# Altium project Line_follower1.PrjPcb
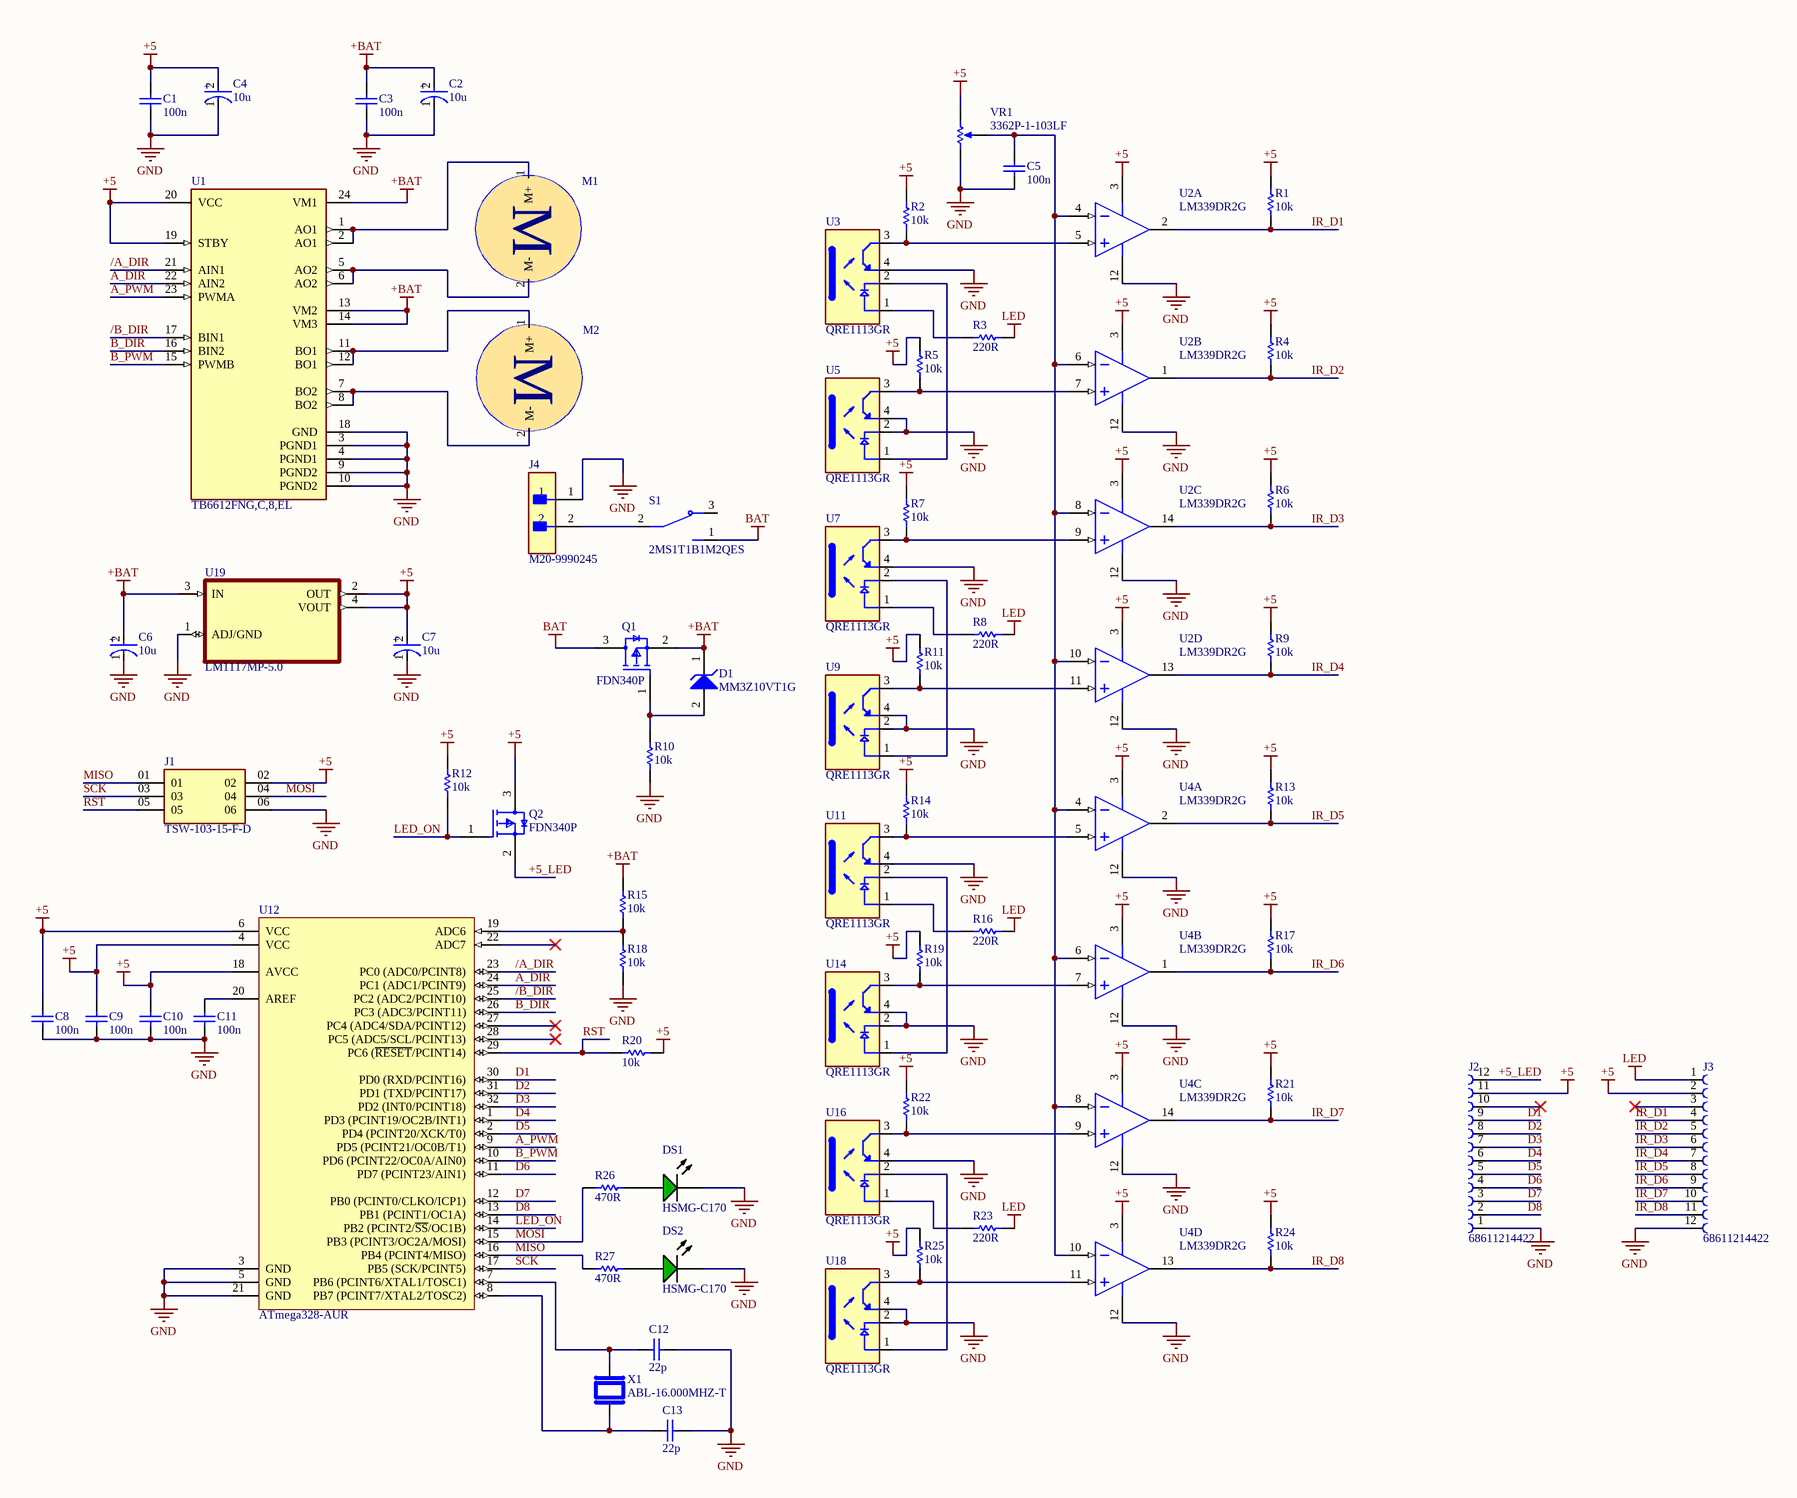
[diagram p0: Line_follower1_Sheet.SchDoc]
1 sheet, 67 parts. Net scope: global (net labels, ports and power ports of the same name join across sheets).
Board file: Line_follower1_PCB.PcbDoc

## Sheet Line_follower1_Sheet.SchDoc
size A2; SheetNumber: 1; SheetTotal: 1

### Parts
C1  100n  [CAPC2013X88X50LL20T25]
C2  10u  [FP-T491B106K020AT-MFG]
C3  100n  [CAPC2013X88X50LL20T25]
C4  10u  [FP-T491B106K020AT-MFG]
C5  100n  [CAPC2013X88X50LL20T25]
C6  10u  [FP-T491B106K020AT-MFG]
C7  10u  [FP-T491B106K020AT-MFG]
C8  100n  [CAPC2013X88X50LL20T25]
C9  100n  [CAPC2013X88X50LL20T25]
C10  100n  [CAPC2013X88X50LL20T25]
C11  100n  [CAPC2013X88X50LL20T25]
C12  22p  [CAPC2013X88X50LL20T25]
C13  22p  [CAPC2013X88X50LL20T25]
D1  MM3Z10VT1G  [ONSC-SOD-323-2-477-02_V]
DS1  HSMG-C170  [AVAG-HSMX-C170_V]
DS2  HSMG-C170  [AVAG-HSMX-C170_V]
J1  TSW-103-15-F-D  [SAMTEC_TSW-103-15-F-D]
J2  68611214422  [68611214422]
J3  68611214422  [68611214422]
J4  M20-9990245  [FP-M20-9990245-MFG]
M1  Component_1  [PCBComponent_1]  (value not drawn)
M2  Component_1  [PCBComponent_1]  (value not drawn)
Q1  FDN340P  [FP-527AG-MFG]
Q2  FDN340P  [FP-527AG-MFG]
R1  10k  [RESC0805(2012)_L]
R2  10k  [RESC0805(2012)_L]
R3  220R  [RESC0805(2012)_L]
R4  10k  [RESC0805(2012)_L]
R5  10k  [RESC0805(2012)_L]
R6  10k  [RESC0805(2012)_L]
R7  10k  [RESC0805(2012)_L]
R8  220R  [RESC0805(2012)_L]
R9  10k  [RESC0805(2012)_L]
R10  10k  [RESC0805(2012)_L]
R11  10k  [RESC0805(2012)_L]
R12  10k  [RESC0805(2012)_L]
R13  10k  [RESC0805(2012)_L]
R14  10k  [RESC0805(2012)_L]
R15  10k  [RESC0805(2012)_L]
R16  220R  [RESC0805(2012)_L]
R17  10k  [RESC0805(2012)_L]
R18  10k  [RESC0805(2012)_L]
R19  10k  [RESC0805(2012)_L]
R20  10k  [RESC0805(2012)_L]
R21  10k  [RESC0805(2012)_L]
R22  10k  [RESC0805(2012)_L]
R23  220R  [RESC0805(2012)_L]
R24  10k  [RESC0805(2012)_L]
R25  10k  [RESC0805(2012)_L]
R26  470R  [RESC0805(2012)_L]
R27  470R  [RESC0805(2012)_L]
S1  2MS1T1B1M2QES  [SW_2MS1T1B1M2QES]
U1  TB6612FNG,C,8,EL  [FP-SSOP24-P-300-0_65A-IPC_A]
U2  LM339DR2G  [ONSC-SOIC-14-751A-03_V]  (parts A,B,C,D of 4)  (no BOM)
U3  QRE1113GR  [SOIC180P460X187-4N]
U4  LM339DR2G  [ONSC-SOIC-14-751A-03_V]  (parts A,B,C,D of 4)
U5  QRE1113GR  [SOIC180P460X187-4N]
U7  QRE1113GR  [SOIC180P460X187-4N]
U9  QRE1113GR  [SOIC180P460X187-4N]
U11  QRE1113GR  [SOIC180P460X187-4N]
U12  ATmega328-AUR  [32A_L]
U14  QRE1113GR  [SOIC180P460X187-4N]
U16  QRE1113GR  [SOIC180P460X187-4N]
U18  QRE1113GR  [SOIC180P460X187-4N]
U19  LM1117MP-5.0  [SOT230P700X180-4N]
VR1  3362P-1-103LF  [BOUR-3362P]
X1  ABL-16.000MHZ-T  [XTAL_HC49P488W46L1150T500H350]

### Nets
+5: C1.2 C4.2(A) C7.2(A) C8.2 C9.2 C10.2 J1.02 J2.11 J3.2 Q2.3(D) R1.2 R2.2 R4.2 R5.2 R6.2 R7.2 R9.2 R11.2 R12.2 R13.2 R14.2 R17.2 R19.2 R20.1 R21.2 R22.2 R24.2 R25.2 U1.19(STBY) U1.20(VCC) U2.3(VCC) U4.3(VCC) U12.4(VCC) U12.6(VCC) U12.18(AVCC) U19.2(OUT) U19.4(VOUT) VR1.3(CW)
+BAT: C2.2(A) C3.2 C6.2(A) D1.1(K) Q1.2(S) R15.2 U1.13(VM2) U1.14(VM3) U1.24(VM1) U19.3(IN)
BAT: Q1.3(D) S1.1
GND: C1.1 C2.1(C) C3.1 C4.1(C) C5.1 C6.1(C) C7.1(C) C8.1 C9.1 C10.1 C11.1 C12.2 C13.2 DS1.2(K) DS2.2(K) J1.06 J2.1 J3.12 J4.1 R10.1 R18.1 U1.3(PGND1) U1.4(PGND1) U1.9(PGND2) U1.10(PGND2) U1.18(GND) U2.12(GND) U3.4(ET) U4.12(GND) U5.2(C) U5.4(ET) U7.4(ET) U9.2(C) U9.4(ET) U11.4(ET) U12.3(GND) U12.5(GND) U12.21(GND) U14.2(C) U14.4(ET) U16.4(ET) U18.2(C) U18.4(ET) U19.1(ADJ/GND) VR1.1(CCW)
LED: J3.1 R3.1 R8.1 R16.1 R23.1
+5_LED: J2.12 Q2.2(S)
/A_DIR: U1.21(AIN1) U12.23(PC0_(ADC0/PCINT8))
/B_DIR: U1.17(BIN1) U12.25(PC2_(ADC2/PCINT10))
A_DIR: U1.22(AIN2) U12.24(PC1_(ADC1/PCINT9))
A_PWM: U1.23(PWMA) U12.9(PD5_(PCINT21/OC0B/T1))
B_DIR: U1.16(BIN2) U12.26(PC3_(ADC3/PCINT11))
B_PWM: U1.15(PWMB) U12.10(PD6_(PCINT22/OC0A/AIN0))
D1: J2.9 U12.30(PD0_(RXD/PCINT16))
D2: J2.8 U12.31(PD1_(TXD/PCINT17))
D3: J2.7 U12.32(PD2_(INT0/PCINT18))
D4: J2.6 U12.1(PD3_(PCINT19/OC2B/INT1))
D5: J2.5 U12.2(PD4_(PCINT20/XCK/T0))
D6: J2.4 U12.11(PD7_(PCINT23/AIN1))
D7: J2.3 U12.12(PB0_(PCINT0/CLKO/ICP1))
D8: J2.2 U12.13(PB1_(PCINT1/OC1A))
IR_D1: J3.4 R1.1 U2.2(OUT1)
IR_D2: J3.5 R4.1 U2.1(OUT2)
IR_D3: J3.6 R6.1 U2.14(OUT3)
IR_D4: J3.7 R9.1 U2.13(OUT4)
IR_D5: J3.8 R13.1 U4.2(OUT1)
IR_D6: J3.9 R17.1 U4.1(OUT2)
IR_D7: J3.10 R21.1 U4.14(OUT3)
IR_D8: J3.11 R24.1 U4.13(OUT4)
LED_ON: Q2.1(G) R12.1 U12.14(PB2_(PCINT2/~{SS}/OC1B))
MISO: J1.01 R27.2 U12.16(PB4_(PCINT4/MISO))
MOSI: J1.04 R26.2 U12.15(PB3_(PCINT3/OC2A/MOSI))
RST: J1.05 R20.2 U12.29(PC6_(~{RESET}/PCINT14))
SCK: J1.03 U12.17(PB5_(SCK/PCINT5))
NetC5_2: C5.2 U2.4(IN1-) U2.6(IN2-) U2.8(IN3-) U2.10(IN4-) U4.4(IN1-) U4.6(IN2-) U4.8(IN3-) U4.10(IN4-) VR1.2(S)
NetC11_2: C11.2 U12.20(AREF)
NetC12_1: C12.1 U12.7(PB6_(PCINT6/XTAL1/TOSC1)) X1.2
NetC13_1: C13.1 U12.8(PB7_(PCINT7/XTAL2/TOSC2)) X1.1
NetD1_2: D1.2(A) Q1.1(G) R10.2
NetDS1_1: DS1.1(A) R26.1
NetDS2_1: DS2.1(A) R27.1
NetJ4_2: J4.2 S1.2
NetM1_1: M1.1(M+) U1.1(AO1) U1.2(AO1)
NetM1_2: M1.2(M-) U1.5(AO2) U1.6(AO2)
NetM2_1: M2.1(M+) U1.11(BO1) U1.12(BO1)
NetM2_2: M2.2(M-) U1.7(BO2) U1.8(BO2)
NetR2_1: R2.1 U2.5(IN1+) U3.3(CT)
NetR3_2: R3.2 U3.1(A)
NetR5_1: R5.1 U2.7(IN2+) U5.3(CT)
NetR7_1: R7.1 U2.9(IN3+) U7.3(CT)
NetR8_2: R8.2 U7.1(A)
NetR11_1: R11.1 U2.11(IN4+) U9.3(CT)
NetR14_1: R14.1 U4.5(IN1+) U11.3(CT)
NetR15_1: R15.1 R18.2 U12.19(ADC6)
NetR16_2: R16.2 U11.1(A)
NetR19_1: R19.1 U4.7(IN2+) U14.3(CT)
NetR22_1: R22.1 U4.9(IN3+) U16.3(CT)
NetR23_2: R23.2 U16.1(A)
NetR25_1: R25.1 U4.11(IN4+) U18.3(CT)
NetU3_2: U3.2(C) U5.1(A)
NetU7_2: U7.2(C) U9.1(A)
NetU11_2: U11.2(C) U14.1(A)
NetU16_2: U16.2(C) U18.1(A)

Not connected (* = marked no-connect by the designer): J2 10(3)*; J3 3(10)*; S1 3; U12 22(ADC7)* 27(PC4_(ADC4/SDA/PCINT12))* 28(PC5_(ADC5/SCL/PCINT13))*

### Notes on the sheet
- (in symbol CMP-2000-07191-2) +
- (in symbol Component_1) M

### Library data of the parts
C1 C3 C5 C8-C13 = CMP-2007-00266-1: 0805; Manufacturer: Kemet; Part Number: C0805C103K5RACTU
C2 C4 C6 C7 = CMP-2000-07191-2: CAP TANT 10UF 10% 20V 1411; Polarity: Polar; Life (Hours): 2000Hour; Dissipation Factor: 6%; Leakage Current: 2uA; Dielectric Material: Tantalum; Ripple Current: 201mA; ESR (Equivalent Series Resistance): 2.1R; Weight: 0.002293oz; Max Operating Temperature: 125°C; Failure Rate: 0.001%; Tolerance: 10%; Case Code (Metric): 3528; Case Code (Imperial): 1411; Number of Pins: 2; Case/Package: 1411; Width: 2.8mm; Height: 1.9mm; Voltage Rating: 20V; Voltage: 20V; Lead Free: Lead Free; Features: General Purpose; Radiation Hardening: No; Min Operating Temperature: -55°C; Length: 3.5mm; Mount: Surface Mount; Depth: 2.8mm; Voltage Rating (DC): 20V; Termination: SMD/SMT; Package Quantity: 1; Capacitance: 10uF; Packaging: Tape and Reel; RoHS Compliant: Yes; REACH SVHC: No SVHC; Height - Seated (Max): 0.083inch
D1 = CMP-1060-00715-1: Zener Voltage Regulator, 300 mW, 2-Pin SOD-323, Pb-Free, Tape and Reel; Manufacturer: On Semiconductor; VZ Typ (V): 10; P Max (W): 0.3; ComponentLink1Description: Manufacturer URL; DatasheetVersion: Rev. 9; PartNumber: MM3Z10VT1G; PackageDescription: 2-Pin SOD, Body 1.7 x 1.25 mm; Packing: Tape and Reel; ComponentLink1URL: http://www.onsemi.com/; PackageReference: SOD-323-2-477-02; PackageVersion: Rev. H, 03/2007; ComponentLink3URL: http://www.onsemi.com/pub_link/Collateral/477-02.PDF.1; Mounting Technology: Surface Mount; RoHS: Pb-Free; ComponentLink2URL: http://www.onsemi.cn/pub_link/Collateral/MM3Z2V4T1-D.PDF; ComponentLink3Description: Package Specification; ComponentLink2Description: Datasheet
DS1 DS2 = CMP-2000-05062-1: Chip LED, Green, 2.2 V, -40 to 85 degC, 2-Pin SMD, Pb-Free, Tape and Reel; Manufacturer: Avago; No. of Pins: 2; Peak Wavelength: 570nm; SVHC: NoSVHC(16-Jun-2014); Dominant Wavelength: 572nm; Forward Current If: 20mA; Viewing Angle: 170deg; Lens Shape: Rectangular; PIV Max: 5V; External Width: 1.25mm; LED Type: Standard; External Depth: 0.8mm; Opto Mounting Orientation: Top; Luminous Intensity: 15mcd; Luminous Intensity Min: 4mcd; Forward Voltage VF Max: 2.6V; External Length / Height: 2mm; Bulb Size: 1.25mmx1.4mm; Light Area Height: 1mm; Voltage Vf Typ: 2.2V; Operating Temperature Max: 85degC; Datasheet Version: Oct-08; MSL: MSL2A-4weeks; Peak Forward Current: 20mA; Package Description: 2-Pin Surface Mount Device, Body 2 x 1.25 mm, Height 0.8 mm; Datasheet URL: https://datasheet.ciiva.com/29280/180495-da-01-en-chip-led-hsmg-c170-gelb-gruen-29280971.pdf; Storage Temperature Min: -40degC; LED Colour: Green; Wavelength Typ: 570nm; Mounting Type: SMD; Forward Current If Max: 20mA; Dominant Wavelength Typ: 572nm; LED Mounting: SMD; Operating Temperature Range: -30degCto+85degC; Operating Temperature Min: -30degC; Manufacturer URL: http://www.avagotech.com/; Packaging: CutTape; Luminous Intensity Typ: 15mcd; Package Reference: HSMX-C170; Storage Temperature Max: 85degC; Opto Case Style: SMD; Forward Voltage: 2.2V
J2 J3 = 68611214422: 12 Position FPC Connector Contacts, Bottom 0.039 (1.00mm) Surface Mount, Right Angle; MF: Wurth Elektronik; SnapEDA_Link: https://www.snapeda.com/parts/68611214422/Wurth+Elektronik/view-part/?ref=snap; Availability: In Stock; Price: None; Value: *; Check_prices: https://www.snapeda.com/parts/68611214422/Wurth+Elektronik/view-part/?ref=eda; Purchase-URL: https://pricing.snapeda.com/search/part/68611214422/?ref=eda; MP: 68611214422; Package: None
J4 = CMP-15831-000105-1: CONN HEADER VERT 2POS 2.54MM; Working Voltage: 750V; Gender: Male; Number of Poles: 2; Current Rating: 3A; Mated Stacking Heights: 16.54mm; Contact Resistance: 25mR; Connector Type: Male Pin; Insulation Resistance: 10GR; Mating Cycles: 300; Voltage: 50V; Flammability Rating: UL94 V-0; Pitch: 2.54mm; Series: M20; Number of Contacts: 2; Height: 0.12inch; Min Operating Temperature: -40°C; Contact Finish - Mating: GOLD; Number of Positions: 2; Number of Rows: 1; Packaging: Bulk; Package Quantity: 1000; Voltage Rating (AC): 750V; Current: 3A; Mount: Through Hole; Case/Package: SIL; Orientation: Straight; Contact Shape: Square; Weight: 0.25lb; Radiation Hardening: No; Fastening Type: Pull; Length: 5.08mm; Depth: 2.54mm; Contact Mating Length: 0.24inch; Housing Material: Nylon; Reach SVHC Compliant: Yes; Insulation Material: Nylon; Color: Black; Width: 0.25inch; Insulation Color: Black; Contact Material: Brass; Contact Type: Male Pin; Termination: Solder; Max Operating Temperature: 105°C; Contact Plating: Gold; Housing Color: Black; Max Current Rating: 3A; Lead Pitch: 2.54mm
M1 M2 = Component_1: Pady do silnika
Q1 Q2 = CMP-2100-03638-2: MOSFET P-CH 20V 2A SSOT3; Fall Time: 11ns; Rise Time: 9ns; Voltage Rating (DC): -20V; Power Dissipation: 500mW; Nominal Vgs: -800mV; Current Rating: -2A; Gate to Source Voltage (Vgs): 8V; Rds On Max: 70mR; Turn-Off Delay Time: 27ns; Element Configuration: Single; Number of Elements: 1; Input Capacitance: 779pF; Drain to Source Resistance: 60mR; Turn-On Delay Time: 10ns; Package Quantity: 1; Mount: Surface Mount; Case/Package: SOT-23; Min Operating Temperature: -55°C; REACH SVHC: No SVHC; Weight: 0.03g; Packaging: Tape and Reel; Threshold Voltage: -800mV; Max Operating Temperature: 150°C; Dual Supply Voltage: -20V; Termination: SMD/SMT; Drain to Source Voltage (Vdss): 20V; Height: 0.94mm; Length: 2.92mm; Contact Plating: Tin; Width: 3.05mm; Drain to Source Breakdown Voltage: -20V; Max Power Dissipation: 500mW; Continuous Drain Current (ID): 2A; Number of Pins: 3; Lead Free: Lead Free; Radiation Hardening: No; On-State Resistance: 70MR
R1 R2 R4-R7 R9-R15 R17-R22 R24 R25 = CMP-1013-00631-1: 10K 0.125W 1% 0805 (2012 Metric)  SMD; Case-Metric: 2012; Case-EIA: 0805; Value: 12000.00 Ohm; Technology: SMT; Tolerance: 1 %; Power: 0.125 W
R3 R8 R16 R23 R26 R27 = CMP-1013-00631-1: 220 0.125W 1% 0805 (2012 Metric)  SMD; Case-Metric: 2012; Case-EIA: 0805; Value: 12000.00 Ohm; Technology: SMT; Tolerance: 1 %; Power: 0.125 W
S1 = 2MS1T1B1M2QES: Toggle Switches Sub-Miniature SPDT switch on-on pc thru-hole; MF: Dailywell; SnapEDA_Link: https://www.snapeda.com/parts/2MS1T1B1M2QES/E%2526E/view-part/?ref=snap; Package: None; Value: *; MP: 2MS1T1B1M2QES; Check_prices: https://www.snapeda.com/parts/2MS1T1B1M2QES/E%2526E/view-part/?ref=eda
U1 = CMP-2100-03693-4: IC MOTOR DRIVER 2.7V-5.5V 24SSOP; Logic Function: AND GATE; Interface: Parallel; Operating Supply Voltage: 3V; Max Supply Voltage: 5.5V; Output Current: 1A; Min Supply Voltage: 2.7V; Number of Outputs: 2; Packaging: Tape and Reel; Mount: Surface Mount; Number of Pins: 24; Min Operating Temperature: -20°C; Case/Package: SSOP; Series: -; Max Operating Temperature: 85°C; Package Quantity: 1
U2 U4 = CMP-1305-00036-1: Single Supply Quad Comparators, 0 to 70 degC, 14-Pin SOIC, Pb-Free, Tape and Reel; Manufacturer: On Semiconductor; IO Typ (mA): 16; ComponentLink3URL: http://www.onsemi.com/pub_link/Collateral/751A-03.PDF; RoHS: TRUE; Packing: Tape and Reel; ComponentLink2Description: Datasheet; ComponentLink2URL: http://www.onsemi.com/pub_link/Collateral/LM339-D.PDF; ComponentLink1Description: Manufacturer URL; PackageVersion: Rev. K, 05/2011; DatasheetVersion: Rev. 20; PackageReference: SOIC-14-751A-03; ComponentLink1URL: http://www.onsemi.com/; PartNumber: LM339DR2G; PackageDescription: 14-Pin Small Outline Integrated Circuit, Body 8.65 x 3.9 mm, Pitch 1.27 mm; ComponentLink3Description: Package Specification; Mounting Technology: Surface Mount
U3 U5 U7 U9 U11 U14 U16 U18 = QRE1113GR: Reflective Optical Sensor 0.039 (1mm) 4-SMD, Gull Wing; MF: ON Semiconductor; Package: ARUSM-313-4 ON Semiconductor; Price: None; Check_prices: https://www.snapeda.com/parts/QRE1113GR/Onsemi/view-part/?ref=eda; Value: *; SnapEDA_Link: https://www.snapeda.com/parts/QRE1113GR/Onsemi/view-part/?ref=snap; MP: QRE1113GR; Availability: In Stock; Purchase-URL: https://pricing.snapeda.com/search/part/QRE1113GR/?ref=eda
U12 = CMP-0095-00268-2: 8-bit AVR Microcontroller, 32KB Flash, 1KB EEPROM, 2KB SRAM, 32-pin TQFP, Industrial Grade (-40°C to 85°C), Reel; PackageDescription: 32-Lead, 7x7x1.0 mm Body, 0.8mm Lead Pitch, Thin Profile Plastic Quad Flat Package (TQFP); ComponentLink1Description: Manufacturer URL; RevisionNote: DatasheetVersion & PackageVersion updated. URLs added.; ComponentLink2URL: http://www.atmel.com/dyn/resources/prod_documents/doc8271.pdf; Code_JEDEC: MS-026-ABA; PackageVersion: revC, Oct-2010; PackageReference: 32A; ComponentLink2Description: ATmega48A/48PA/88A/88PA/168A/168PA/328/328P Datasheet; ComponentLink3Description: ATmega48A/48PA/88A/88PA/168A/168PA/328/328P Summary; ComponentLink1URL: http://www.atmel.com/; DatasheetVersion: revD, May-2011; ComponentLink3URL: http://www.atmel.com/dyn/resources/prod_documents/8271S.pdf
U19 = LM1117MP-5.0: Space Saving 800mA Low-Dropout Linear Regulator with Internal Current Limit; MF: Texas Instruments; MP: LM1117MP-5.0/NOPB; DigiKey-Purchase-URL: https://snapeda.com/shop?store=DigiKey&id=22380; Package: SOT-223-4 Texas Instruments; Mouser-Purchase-URL: https://snapeda.com/shop?store=Mouser&id=22380; Value: *; SnapEDA_Link: https://www.snapeda.com/parts/LM1117MP-5.0/NOPB/Texas%20Instruments/view-part/22380/?ref=snap; Availability: Unavailable; Price: None; Texas_Instruments-Purchase-URL: https://snapeda.com/shop?store=Texas+Instruments&id=22380
VR1 = CMP-1747-00004-1: Square Trimpot(R) Trimming Potentiometer, 10 KOhm, 300 V, -55 to 125 degC, 3-Pin THD, RoHS, Tube; Voltage Rating: 220 mV; Power Rating: 1 W; Tolerance: 1%; Resistance: 50 mohm; Case/Package: 1206; Length: 3.2 mm; RoHSCompliant: True; PackageDescription: 3-Pin Through Hole Device, Body 6.6 x 6.99 mm, Pitch 2.54 mm; ComponentLink2Description: Datasheet; REACH SVHC: No SVHC; Mount: Surface Mount; Height: 0.6 mm; Packaging: Tape and Reel; ComponentLink1URL: http://www.bourns.com/; Case Code (Imperial): 0612; Pins: 2; Case Code (Metric): 1632; ComponentLink2URL: http://www.bourns.com/docs/Product-Datasheets/3362.pdf; Min Operating Temperature: -25degC; ComponentLink1Description: Manufacturer URL; PackageReference: 3326P; Max Operating Temperature: 125degC; Width: 1.6 mm; Package Quantity: 5000; DatasheetVersion: May-16
X1 = ABL-16.000MHZ-T: 16 MHz Â±10ppm Crystal 18pF 40 Ohms HC-49/US; MF: Abracon Corporation; Package: None; Purchase-URL: https://pricing.snapeda.com/search/part/ABL-16.000MHZ/?ref=eda; Value: *; Availability: In Stock; SnapEDA_Link: https://www.snapeda.com/parts/ABL-16.000MHZ/Abracon/view-part/?ref=snap; MP: ABL-16.000MHZ; Price: None; Check_prices: https://www.snapeda.com/parts/ABL-16.000MHZ/Abracon/view-part/?ref=eda
J1 = TSW-103-15-F-D: Package: None; Price: None; Value: *; MP: TSW-103-15-F-D; Availability: Unavailable